# EAGLE design IRKit (EAGLE 6.5.0)
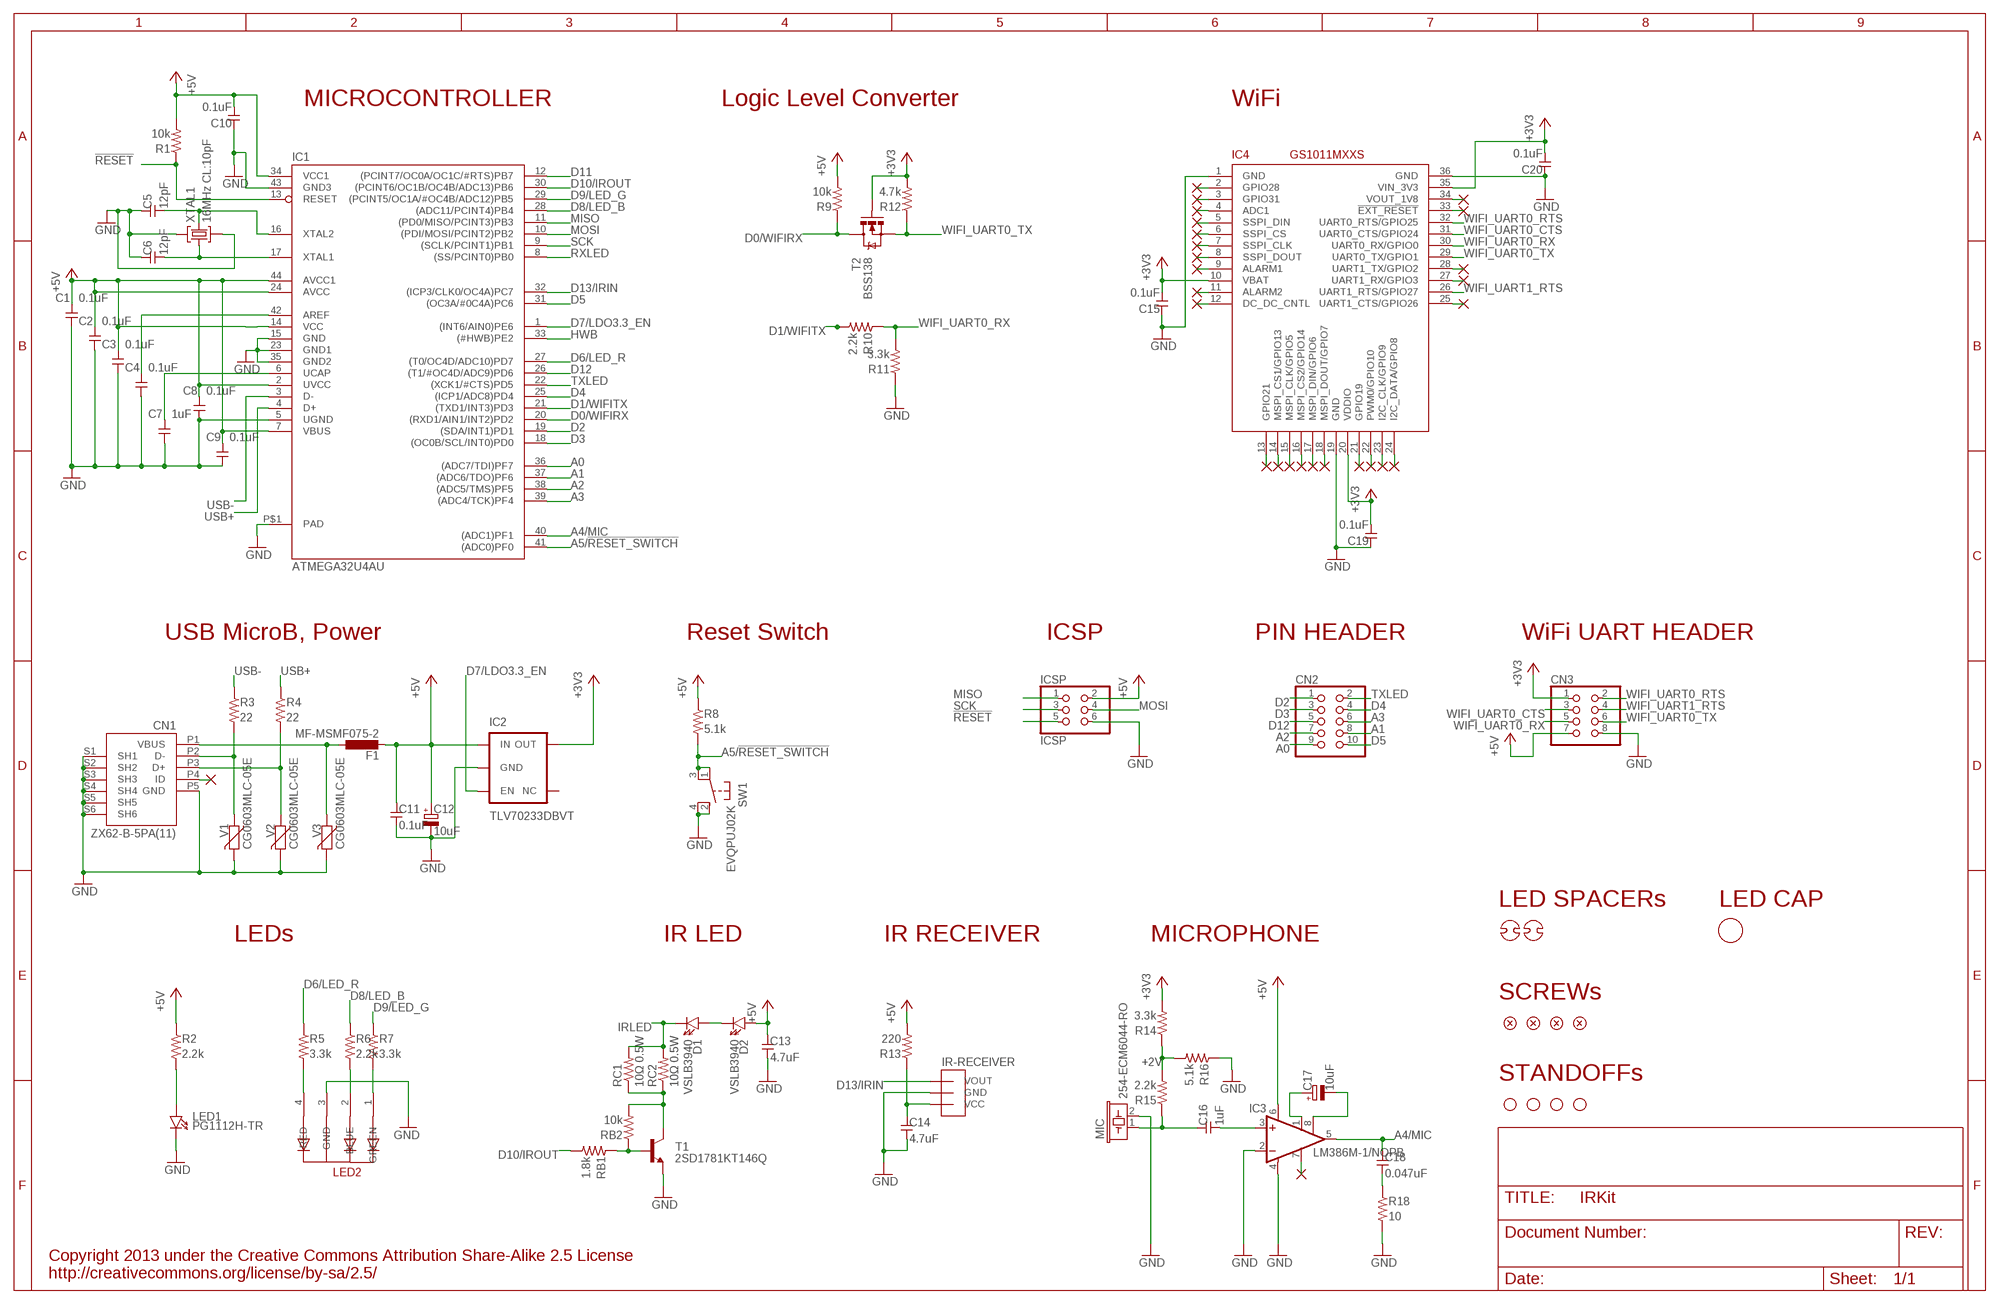
[diagram p0: schematic, sheet 1]

## Parts
C1  0.1uF  CAPACITOR2012  [SMD2012]
C2  0.1uF  CAPACITOR2012  [SMD2012]
C3  0.1uF  CAPACITOR2012  [SMD2012]
C4  0.1uF  CAPACITOR2012  [SMD2012]
C5  12pF  CAPACITOR2012  [SMD2012]
C6  12pF  CAPACITOR2012  [SMD2012]
C7  1uF  CAPACITOR2012  [SMD2012]
C8  0.1uF  CAPACITOR2012  [SMD2012]
C9  0.1uF  CAPACITOR2012  [SMD2012]
C10  0.1uF  CAPACITOR2012  [SMD2012]
C11  0.1uF  CAPACITOR2012  [SMD2012]
C12  10uF  CAPACITOR-POLPANASONIC_B  [PANASONIC_B]
C13  4.7uF  CAPACITOR2012  [SMD2012]
C14  4.7uF  CAPACITOR2012  [SMD2012]
C15  0.1uF  CAPACITOR2012  [SMD2012]
C16  1uF  CAPACITOR2012  [SMD2012]
C17  10uF  CAPACITOR-POLPANASONIC_B  [PANASONIC_B]
C18  0.047uF  CAPACITOR2012  [SMD2012]
C19  0.1uF  CAPACITOR2012  [SMD2012]
C20  0.1uF  CAPACITOR2012  [SMD2012]
CN1  ZX62-B-5PA(11)  USB-CONNECTORMICROB  [USB-MICROB]
CN2  PINHD-2X5  [2X05]
CN3  PINHD-2X4  [2X04]
D1  VSLB3940  LED-3MM  [LED3MM]
D2  VSLB3940  LED-3MM  [LED3MM]
F1  MF-MSMF075-2  L-EUL1812  [L1812]
IC1  ATMEGA32U4AU  [TQFP44-PAD]
IC2  TLV70233DBVT  TLV702XXSMD  [SOT23-5]
IC3  LM386M-1/NOPB  LM386M-1  [SO08]
IC4  GS1011MXXS  [GS1011MXXS]
ICSP  ICSP  PINHD-2X3  [2X03]
IR-RECEIVER  PL-IRM2161  [IR-RECEIVER]
LED1  PG1112H-TR  LED-2012  [LED2012]
LED2  5MMRGBLED  [LED5MMRGB]
LEDCAP1  LED-CAP  [LED-CAP]
MIC  254-ECM6044-RO  MICELECTRET_SMD  [MIC_SMD_4MM]
R1  10k  RESISTOR-US2012  [SMD2012]
R2  2.2k  RESISTOR-US2012  [SMD2012]
R3  22  RESISTOR-US2012  [SMD2012]
R4  22  RESISTOR-US2012  [SMD2012]
R5  3.3k  RESISTOR-US2012  [SMD2012]
R6  2.2k  RESISTOR-US2012  [SMD2012]
R7  3.3k  RESISTOR-US2012  [SMD2012]
R8  5.1k  RESISTOR-US2012  [SMD2012]
R9  10k  RESISTOR-US2012  [SMD2012]
R10  2.2k  RESISTOR-US2012  [SMD2012]
R11  3.3k  RESISTOR-US2012  [SMD2012]
R12  4.7k  RESISTOR-US2012  [SMD2012]
R13  220  RESISTOR-US2012  [SMD2012]
R14  3.3k  RESISTOR-US2012  [SMD2012]
R15  2.2k  RESISTOR-US2012  [SMD2012]
R16  5.1k  RESISTOR-US2012  [SMD2012]
R18  10  RESISTOR-US2012  [SMD2012]
RB1  1.8k  RESISTOR-US2012  [SMD2012]
RB2  10k  RESISTOR-US2012  [SMD2012]
RC1  10Ω 0.5W  R3225  [3225]
RC2  10Ω 0.5W  R3225  [3225]
SCREW1  flat-head M3 self-tapping  SCREW  [SCREW-M3]
SCREW2  flat-head M3 self-tapping  SCREW  [SCREW-M3]
SCREW3  flat-head M3 self-tapping  SCREW  [SCREW-M3]
SCREW4  flat-head M3 self-tapping  SCREW  [SCREW-M3]
SP1  LK-5  LED-SPACER-LK  [LED-SPACER-LK]
SP2  LK-5  LED-SPACER-LK  [LED-SPACER-LK]
STANDOFF1  STAND-OFF  [STAND-OFF]
STANDOFF2  STAND-OFF  [STAND-OFF]
STANDOFF3  STAND-OFF  [STAND-OFF]
STANDOFF4  STAND-OFF  [STAND-OFF]
SW1  EVQPUJ02K  TACTILE-SWITCHEVQPUJ02K  [TACTILE-SWITCH-EVQPUJ02K]
T1  2SD1781KT146Q  MMUN2211LT1-NPN-SC59-BEC  [SC59-BEC]
T2  BSS138  [SOT23]
V1  CG0603MLC-05E  VARISTORCN0603  [CT/CN0603]
V2  CG0603MLC-05E  VARISTORCN0603  [CT/CN0603]
V3  CG0603MLC-05E  VARISTORCN0603  [CT/CN0603]
XTAL1  16MHz CL:10pF  CRYSTAL-3.2-2.5  [CRYSTAL-3.2-2.5]

## Nets
!RESET: IC1.13(RESET) ICSP.5 R1.1
+2V: R14.1 R15.2 R16.2
+3V3 [3.3v]: C15.2 C19.2 C20.2 CN3.1 IC2.5(OUT) IC4.10(VBAT) IC4.20(VDDIO) IC4.35(VIN_3V3) R12.2 R14.2 T2.1(G)
+5V [power]: C1.2 C2.2 C3.2 C8.2 C9.2 C10.2 C11.1 C12.+ C13.1 CN3.7 D2.A F1.2 IC1.2(UVCC) IC1.7(VBUS) IC1.14(VCC) IC1.24(AVCC) IC1.34(VCC1) IC1.44(AVCC1) IC2.1(IN) IC3.6(VS) ICSP.2 R1.2 R2.1 R8.1 R9.2 R13.2
A0: CN2.9 IC1.36((ADC7/TDI)PF7)
A1: CN2.8 IC1.37((ADC6/TDO)PF6)
A2: CN2.7 IC1.38((ADC5/TMS)PF5)
A3: CN2.6 IC1.39((ADC4/TCK)PF4)
A4/MIC: C18.1 IC1.40((ADC1)PF1) IC3.5(OUT)
A5/!RESET_SWITCH: IC1.41((ADC0)PF0) R8.2 SW1.1(A) SW1.3(A)
AREF [power]: C4.2 IC1.42(AREF)
D0/WIFIRX: IC1.20((RXD1/AIN1/INT2)PD2) R9.1 T2.3(D)
D1/WIFITX: IC1.21((TXD1/INT3)PD3) R10.2
D2: CN2.1 IC1.19((SDA/INT1)PD1)
D3: CN2.3 IC1.18((OC0B/SCL/INT0)PD0)
D4: CN2.4 IC1.25((ICP1/ADC8)PD4)
D5: CN2.10 IC1.31((OC3A/#0C4A)PC6)
D6/LED_R: IC1.27((T0/OC4D/ADC10)PD7) R5.1
D7/LDO3.3_EN: IC1.1((INT6/AIN0)PE6) IC2.3(EN)
D8/LED_B: IC1.28((ADC11/PCINT4)PB4) R6.1
D9/LED_G: IC1.29((PCINT5/OC1A/#OC4B/ADC12)PB5) R7.1
D10/IROUT: IC1.30((PCINT6/OC1B/OC4B/ADC13)PB6) RB1.2
D11: IC1.12((PCINT7/OC0A/OC1C/#RTS)PB7)
D12: CN2.5 IC1.26((T1/#OC4D/ADC9)PD6)
D13/IRIN: IC1.32((ICP3/CLK0/OC4A)PC7) IR-RECEIVER.1(VOUT)
GND [gnd]: C1.1 C2.1 C3.1 C4.1 C5.1 C6.1 C7.1 C8.1 C9.1 C10.1 C11.2 C12.- C13.2 C14.2 C15.1 C19.1 C20.1 CN1.P5(GND) CN1.S1(SH1) CN1.S2(SH2) CN1.S3(SH3) CN1.S4(SH4) CN1.S5(SH5) CN1.S6(SH6) CN3.8 IC1.5(UGND) IC1.15(GND) IC1.23(GND1) IC1.35(GND2) IC1.43(GND3) IC1.P$1(PAD) IC2.2(GND) IC3.2(-IN) IC3.4(GND) IC4.1(GND) IC4.19(GND) IC4.36(GND) ICSP.6 IR-RECEIVER.2(GND) LED1.K LED2.3(GND) MIC.2 R11.1 R16.1 R18.2 SW1.2(B) SW1.4(B) T1.E V1.2 V2.2 V3.2 XTAL1.2(GND) XTAL1.4(GND)
HWB: IC1.33((#HWB)PE2)
IRLED [ir-power]: D1.K RC1.2 RC2.2
MICOUT: C16.1 MIC.1 R15.1
MISO: IC1.11((PD0/MISO/PCINT3)PB3) ICSP.1
MOSI: IC1.10((PDI/MOSI/PCINT2)PB2) ICSP.4
N$1: C17.- IC3.8(GAIN)
N$3: LED1.A R2.2
N$4: C16.2 IC3.3(+IN)
N$5: LED2.1(GREEN) R7.2
N$6: IC3.7(BYPASS)
N$8: C17.+ IC3.1(GAIN)
N$10: RB1.1 RB2.1 T1.B
N$11 [ir-power]: RB2.2 RC1.1 RC2.1 T1.C
N$14: C18.2 R18.1
N$16: C14.1 IR-RECEIVER.3(VCC) R13.1
N$17: LED2.2(BLUE) R6.2
N$18: IC4.2(GPIO28)
N$19: IC4.8(SSPI_DOUT)
N$20: IC4.9(ALARM1)
N$21: IC4.3(GPIO31)
N$22: IC4.4(ADC1)
N$23: IC4.5(SSPI_DIN)
N$24: IC4.6(SSPI_CS)
N$25: IC4.7(SSPI_CLK)
N$26: IC4.11(ALARM2)
N$27: IC4.12(DC_DC_CNTL)
N$28: IC4.13(GPIO21)
N$29: IC4.14(MSPI_CS1/GPIO13)
N$30: IC4.15(MSPI_CLK/GPIO5)
N$31: IC4.16(MSPI_CS2/GPIO14)
N$32: IC4.17(MSPI_DIN/GPIO6)
N$33: IC4.18(MSPI_DOUT/GPIO7)
N$34: IC4.21(GPIO19)
N$35: IC4.22(PWM0/GPIO10)
N$36: IC4.23(I2C_CLK/GPIO9)
N$37: IC4.24(I2C_DATA/GPIO8)
N$38: IC4.25(UART1_CTS/GPIO26)
N$39: IC4.27(UART1_RX/GPIO3)
N$40: IC4.28(UART1_TX/GPIO2)
N$41: LED2.4(RED) R5.2
N$43: IC4.34(VOUT_1V8)
N$44: IC4.33(!EXT_RESET)
N$48: CN1.P2(D-) R3.2 V1.1
N$51: CN1.P3(D+) R4.2 V2.1
N$52: CN1.P1(VBUS) F1.1 V3.1
N$58 [power]: D1.A D2.K
RXLED: IC1.8((SS/PCINT0)PB0)
SCK: IC1.9((SCLK/PCINT1)PB1) ICSP.3
TXLED: CN2.2 IC1.22((XCK1/#CTS)PD5)
UCAP: C7.2 IC1.6(UCAP)
USB+: IC1.4(D+) R4.1
USB-: IC1.3(D-) R3.1
USB-ID: CN1.P4(ID)
WIFI_UART0_CTS: CN3.3 IC4.31(UART0_CTS/GPIO24)
WIFI_UART0_RTS: CN3.2 IC4.32(UART0_RTS/GPIO25)
WIFI_UART0_RX: CN3.5 IC4.30(UART0_RX/GPIO0) R10.1 R11.2
WIFI_UART0_TX: CN3.6 IC4.29(UART0_TX/GPIO1) R12.1 T2.2(S)
WIFI_UART1_RTS: CN3.4 IC4.26(UART1_RTS/GPIO27)
XTAL1: C6.2 IC1.17(XTAL1) XTAL1.1(C1)
XTAL2: C5.2 IC1.16(XTAL2) XTAL1.3(C2)
Unconnected: IC2.4(NC)

## Notes on the sheet
- MICROCONTROLLER | Logic Level Converter | WiFi
- USB MicroB, Power | Reset Switch | ICSP | PIN HEADER | WiFi UART HEADER
- LED SPACERs | LED CAP
- LEDs | IR LED | IR RECEIVER | MICROPHONE
- SCREWs
- STANDOFFs
- Copyright 2013 under the Creative Commons Attribution Share-Alike 2.5 License
  http://creativecommons.org/license/by-sa/2.5/

## Library data of the parts
C1-C11 C13-C16 C18-C20 = my:CAPACITOR: Generic Capacitor
C12 C17 = my:CAPACITOR-POL: Generic Capacitor with Polarity
CN1 = my:USB-CONNECTOR
CN2 = my:PINHD-2X5: PIN HEADER
CN3 = my:PINHD-2X4: PIN HEADER
D1 D2 LED1 = my:LED: Through-hole LED
F1 = my:L-EU: INDUCTOR, European symbol
IC1 = my:ATMEGA32U4
IC2 = my:TLV702XX: TLV702xx http://www.tij.co.jp/jp/lit/ds/symlink/tlv70233.pdf http://www.ti.com/lit/ds/slvsag6b/slvsag6b.pdf 300-mA, Low-IQ, Low-Dropout Regulator
IC3 = my:LM386?-*: Low Voltage Audio Power Amplifier Source: http://cache.national.com/ds/LM/LM386.pdf
IC4 = my:GS1011MXXS
ICSP = my:PINHD-2X3: PIN HEADER
IR-RECEIVER = my:PL-IRM2161: PL-IRM2161-XD1 IR Receiver http://akizukidenshi.com/catalog/g/gI-06491/ http://akizukidenshi.com/download/ds/paralight/PL-IRM2161-XD1.pdf
LED2 = my:5MMRGBLED
LEDCAP1 = my:LED-CAP
MIC = my:MIC: Omni-directional electret condenser microphone.
R1-R16 R18 RB1 RB2 = my:RESISTOR-US: Generic Registor
RC1 RC2 = my:R: RESISTOR
SCREW1-SCREW4 = my:SCREW
SP1 SP2 = my:LED-SPACER
STANDOFF1-STANDOFF4 = my:STAND-OFF: #4 Stand Off This is the mechanical footprint for a #4 phillips button head screw. Use the keepout ring to avoid running the screw head into surrounding components. SKU : PRT-00447
SW1 = my:TACTILE-SWITCH: TACTILE SWITCH
T1 = transistor:*-NPN-: NPN Transistror BF959 corrected 2008.03.06
T2 = my:BSS138
V1-V3 = my:VARISTOR: VARISTOR
XTAL1 = my:CRYSTAL-3.2-2.5

## Net classes
0 default: width 0.254 mm
1 power: width 0.406 mm
2 ir-power: width 0.813 mm
3 gnd: width 0.406 mm
4 3.3v: width 0.406 mm

## Board
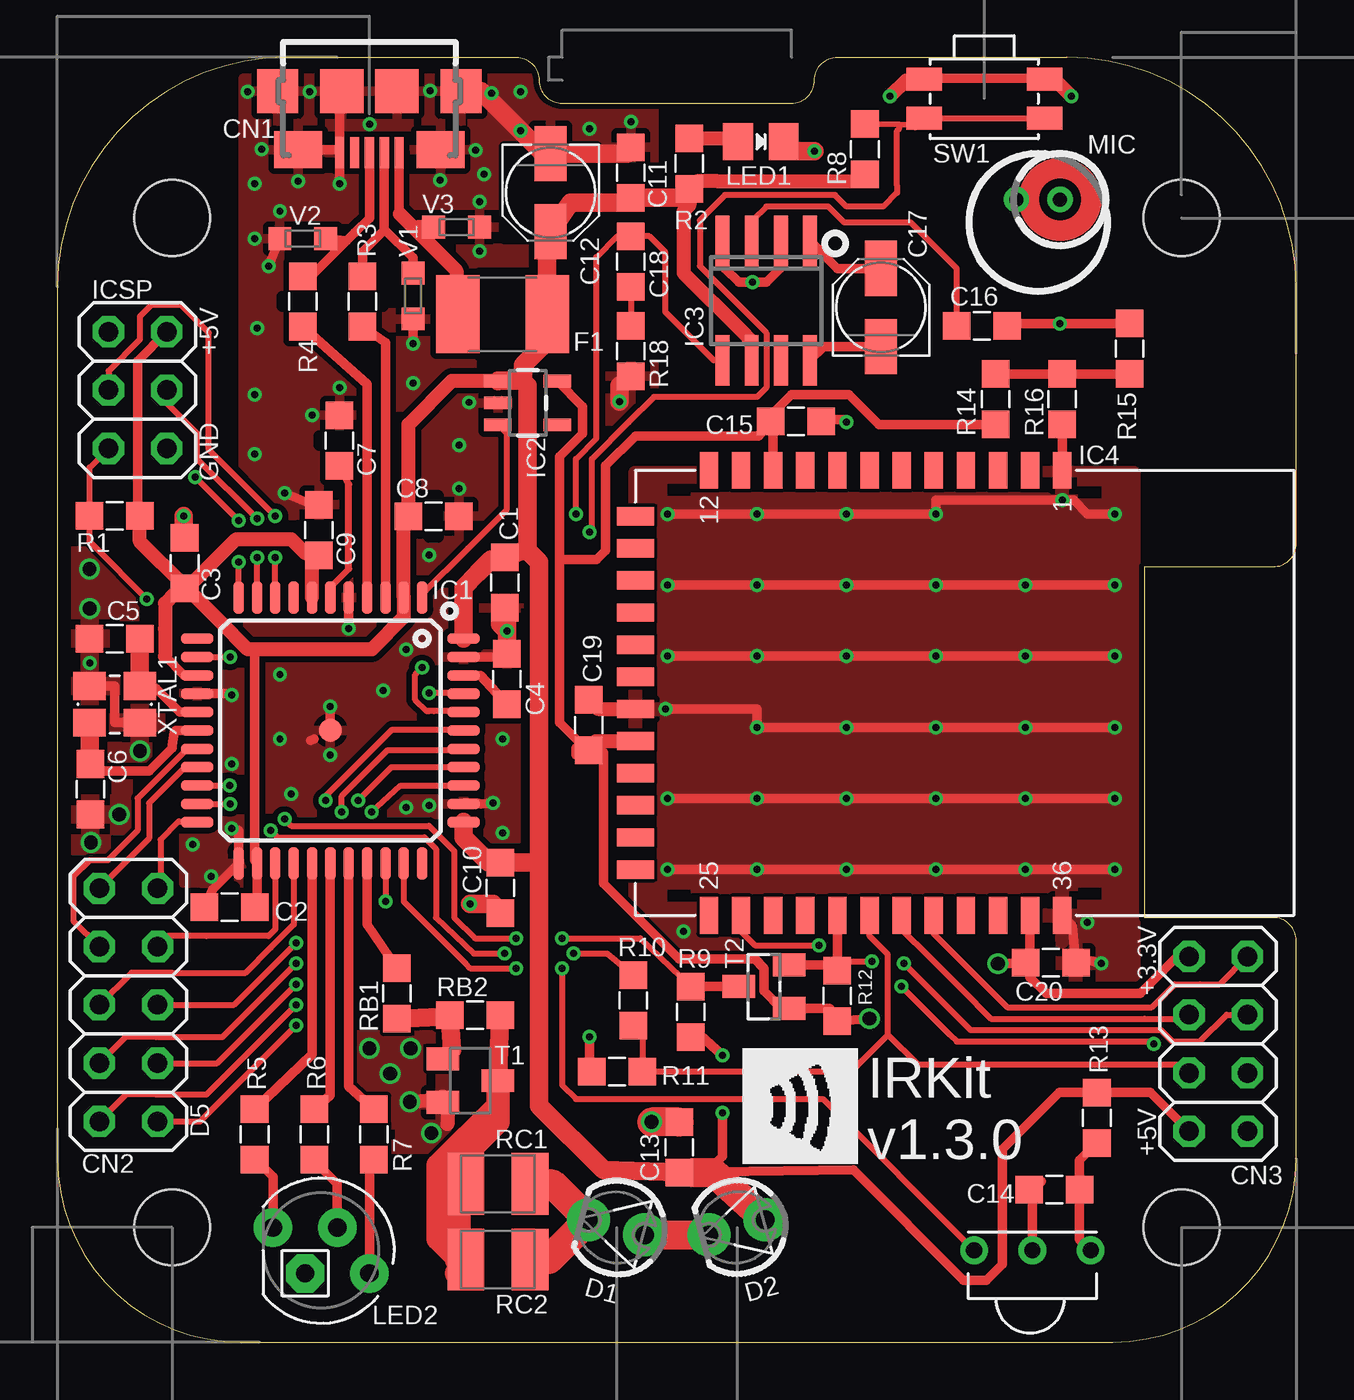
[diagram p1: board, top side]
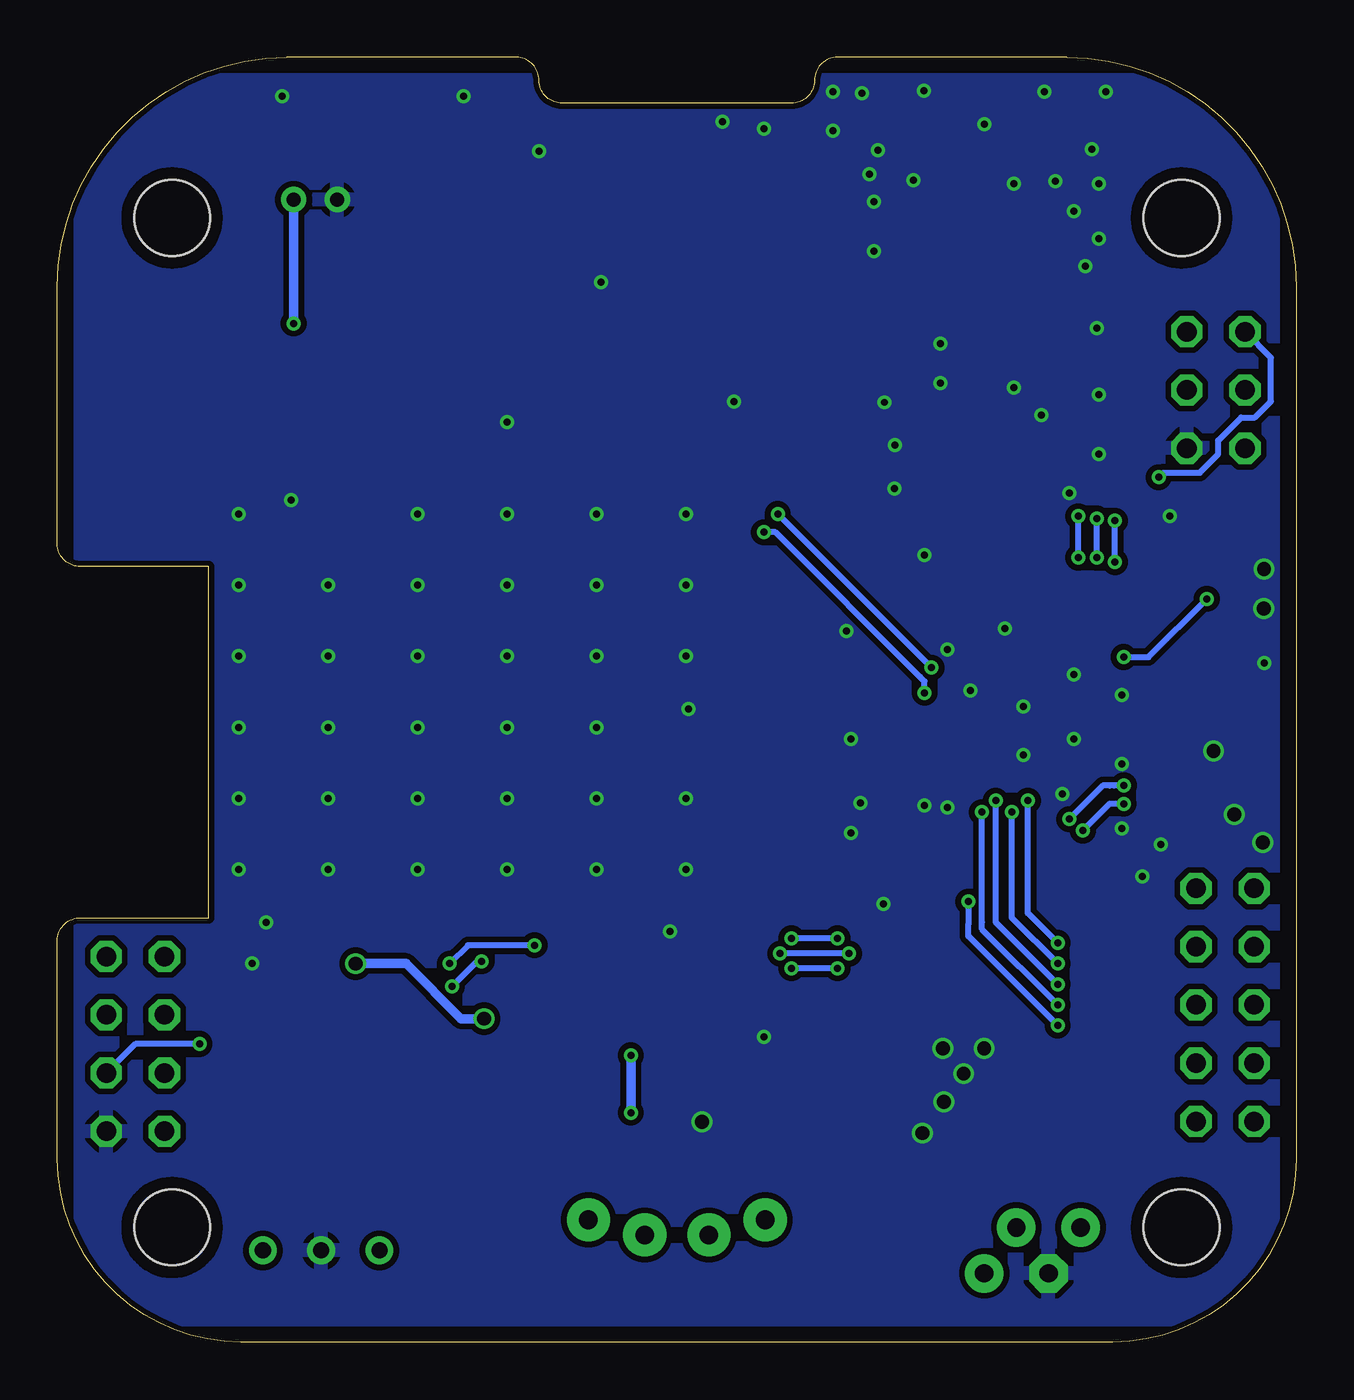
[diagram p2: board, bottom side, seen from below]

Size 54 x 56 mm. Coordinates in mm from the lower left corner, seen from the top.
Outline: 8,0 46,0 arc90 54,8 54,17.5 arc90 53,18.5 47.4,18.5 47.4,33.6 47.4,33.8 53,33.8 arc90 54,34.8 54,46 arc90 44,56 34,56 arc90 33,55 arc-90 32,54 22,54 arc-90 21,55 arc90 20,56 10,56 arc90 0,46 0,8 arc90 8,0
Copper layers (1*16): Top 0.035mm / dielectric 1.5mm / Bottom 0.035mm
Design rules "Fusion_eagle_rule_v1.1": minimum track width 6mil, minimum drill 12mil, track to track 6mil, track to pad 6mil, pad to pad 6mil, via to via 6mil, smd to smd 0mil, copper to edge 10mil, drill to drill 10mil, minimum pad ring 10mil, minimum via ring 6mil, stop-mask expansion 2mil, vias tented up to drill 100mil, thermal gap 10mil

### Footprints (pad centres in the part's own frame; a part is rotated, then mirrored left to right if it is on the bottom)
SMD2012 = smd 1.2 x 1.2: 1 -1.1,0; 2 1.1,0
PANASONIC_B = smd 2.4 x 1.4: + 1.7,0; - -1.7,0
USB-MICROB = smd 0.4 x 1.35: P1 -1.3,2.675; P2 -0.65,2.675; P3 0,2.675; P4 0.65,2.675; P5 1.3,2.675 | smd 1.8 x 1.9: S1 -4,0; S2 4,0 | smd 2.1 x 1.6: S3 -3.1,2.55; S4 3.1,2.55 | smd 1.9 x 1.9: S5 -1.2,0; S6 1.2,0
2X05 = drill 0.85 octagon: 1 -5.08,-1.27; 2 -5.08,1.27; 3 -2.54,-1.27; 4 -2.54,1.27; 5 0,-1.27; 6 0,1.27; 7 2.54,-1.27; 8 2.54,1.27; 9 5.08,-1.27; 10 5.08,1.27
2X04 = drill 0.85 octagon: 1 -3.81,-1.27; 2 -3.81,1.27; 3 -1.27,-1.27; 4 -1.27,1.27; 5 1.27,-1.27; 6 1.27,1.27; 7 3.81,-1.27; 8 3.81,1.27
LED3MM = drill 0.813 pad 1.88: A -1.27,0; K 1.27,0
L1812 = smd 1.9 x 3.4: 1 -1.95,0; 2 1.95,0
TQFP44-PAD = smd 1.4 x 0.45: 1 -5.8,4; 2 -5.8,3.2; 3 -5.8,2.4; 4 -5.8,1.6; 5 -5.8,0.8; 6 -5.8,0; 7 -5.8,-0.8; 8 -5.8,-1.6; 9 -5.8,-2.4; 10 -5.8,-3.2; 11 -5.8,-4; 23 5.8,-4; 24 5.8,-3.2; 25 5.8,-2.4; 26 5.8,-1.6; 27 5.8,-0.8; 28 5.8,0; 29 5.8,0.8; 30 5.8,1.6; 31 5.8,2.4; 32 5.8,3.2; 33 5.8,4 | smd 0.45 x 1.4: 12 -4,-5.8; 13 -3.2,-5.8; 14 -2.4,-5.8; 15 -1.6,-5.8; 16 -0.8,-5.8; 17 0,-5.8; 18 0.8,-5.8; 19 1.6,-5.8; 20 2.4,-5.8; 21 3.2,-5.8; 22 4,-5.8; 34 4,5.8; 35 3.2,5.8; 36 2.4,5.8; 37 1.6,5.8; 38 0.8,5.8; 39 0,5.8; 40 -0.8,5.8; 41 -1.6,5.8; 42 -2.4,5.8; 43 -3.2,5.8; 44 -4,5.8 | smd 1 x 1: P$1 0,0
SOT23-5 = smd 0.55 x 1.2: 1 -0.95,-1.3; 2 0,-1.3; 3 0.95,-1.3; 4 0.95,1.3; 5 -0.95,1.3
SO08 = smd 0.6 x 2.2: 1 -1.905,-2.6; 2 -0.635,-2.6; 3 0.635,-2.6; 4 1.905,-2.6; 5 1.905,2.6; 6 0.635,2.6; 7 -0.635,2.6; 8 -1.905,2.6
GS1011MXXS = smd 1.6 x 0.8: 1 0,18.6; 2 0,17.2; 3 0,15.8; 4 0,14.4; 5 0,13; 6 0,11.6; 7 0,10.2; 8 0,8.8; 9 0,7.4; 10 0,6; 11 0,4.6; 12 0,3.2; 25 19.4,3.2; 26 19.4,4.6; 27 19.4,6; 28 19.4,7.4; 29 19.4,8.8; 30 19.4,10.2; 31 19.4,11.6; 32 19.4,13; 33 19.4,14.4; 34 19.4,15.8; 35 19.4,17.2; 36 19.4,18.6 | smd 0.8 x 1.6: 13 2,0; 14 3.4,0; 15 4.8,0; 16 6.2,0; 17 7.6,0; 18 9,0; 19 10.4,0; 20 11.8,0; 21 13.2,0; 22 14.6,0; 23 16,0; 24 17.4,0
2X03 = drill 0.85 octagon: 1 -2.54,-1.27; 2 -2.54,1.27; 3 0,-1.27; 4 0,1.27; 5 2.54,-1.27; 6 2.54,1.27
IR-RECEIVER = drill 0.7: 1 -2.54,0; 2 0,0; 3 2.54,0
LED2012 = smd 1.3 x 1.6: A -1,0; K 1,0
LED5MMRGB = drill 0.8 pad 1.676: 1 2.1,-1; 2 0.7,1; 4 -2.1,1 | drill 0.8 pad 1.676 octagon: 3 -0.7,-1
MIC_SMD_4MM = drill 0.6: 1 1.9,0; 2 0,0
3225 = smd 1.6 x 2.7: 1 -1.4,0; 2 1.4,0
STAND-OFF = hole 3.302: 0,0
TACTILE-SWITCH-EVQPUJ02K = smd 1.55 x 1: 1 -2.625,-0.85; 2 -2.625,0.85; 3 2.625,-0.85; 4 2.625,0.85
SC59-BEC = smd 1 x 1.4: B -0.95,-1.2; C 0,1.2; E 0.95,-1.2
SOT23 = smd 1 x 1.4: 1 -0.95,-1.1; 2 0.95,-1.1; 3 0,1.1
CT/CN0603 = smd 1 x 1: 1 -1,0; 2 1,0
CRYSTAL-3.2-2.5 = smd 1.4 x 1.2: 1 -1.1,-0.8; 2 1.1,-0.8; 3 1.1,0.8; 4 -1.1,0.8

### Placement (x,y rotation side)
C1  19.5,33.1 90 top
C2  7.51,18.95 0 top
C3  5.55,33.95 270 top
C4  19.6,28.9 270 top
C5  2.5,30.66 0 top
C6  1.44,24.1 90 top
C7  12.3,39.3 270 top
C8  16.4,36 180 top
C9  11.4,35.4 270 top
C10  19.3,19.8 90 top
C11  25,50.97 90 top
C12  21.5,50.1 270 top
C13  27.1,8.5 90 top
C14  43.45,6.65 180 top
C15  32.2,40.14 180 top
C16  40.3,44.3 180 top
C17  35.9,45.1 90 top
C18  25,47.1 270 top
C19  23.16,26.9 270 top
C20  43.3,16.54 180 top
CN1  13.6,54.52 180 top
CN2  3.1,14.7 270 top
CN3  50.6,13 270 top
D1  24.38,5 165 top
D2  29.62,5 195 top
F1  19.4,44.8 0 top
IC1  11.9,26.66 270 top
IC2  20.5,40.94 270 top
IC3  30.9,45.4 180 top
IC4  25.2,38 270 top
ICSP  3.5,41.5 270 top
IR-RECEIVER  42.5,4 0 top
LED1  30.66,52.33 0 top
LED2  11.5,4 0 top
LEDCAP1  11.5,-0.7 0 top
MIC  41.8,49.8 0 top
R1  2.5,36.02 0 top
R2  27.55,51.38 90 top
R3  13.3,45.36 90 top
R4  10.7,45.36 90 top
R5  8.6,9.05 270 top
R6  11.2,9.05 270 top
R7  13.8,9.05 270 top
R8  35.2,52 90 top
R9  27.6,14.4 270 top
R10  25.1,14.9 90 top
R11  24.4,11.8 0 top
R12  34,15.1 270 top
R13  45.31,9.78 90 top
R14  40.9,41.1 270 top
R15  46.74,43.3 270 top
R16  43.8,41.1 90 top
R18  25,43.2 270 top
RB1  14.8,15.2 90 top
RB2  18.2,14.26 0 top
RC1  19.2,6.9 0 top
RC2  19.2,3.6 0 top
SCREW1  -7.4,-11.1 0 top  (outside the outline)
SCREW2  -8.4,-12.2 0 top  (outside the outline)
SCREW3  -9.4,-13.3 0 top  (outside the outline)
SCREW4  -10.4,-14.4 0 top  (outside the outline)
SP1  29.62,5 195 top
SP2  24.38,5 345 top
STANDOFF1  49,5 0 top
STANDOFF2  5,5 0 top
STANDOFF3  49,49 0 top
STANDOFF4  5,49 0 top
SW1  40.4,54.2 0 top
T1  18,11.4 270 top
T2  30.8,15.5 90 top
U$1  [IRKIT-LOGO]  29.9,7.8 0 top
V1  15.5,45.6 270 top
V2  10.7,48.1 180 top
V3  17.4,48.6 0 top
XTAL1  2.5,27.8 0 top

### Tracks (layer width: path | path; a pad name or v marks a point on that pad's centre or on a via)
!RESET  (via drill 0.3)
  Top 0.254: IC1.13 v7.53,29.86 | v3.9,32.4 1.6,34.7 1.4,34.9 R1.1 1.4,38.13 ICSP.5
  Bottom 0.254: v7.53,29.86 6.44,29.86 v3.9,32.4
+2V
  Top 0.406: R14.1 R16.2 R15.2
+3V3  (via drill 0.6)
  Top 0.406: IC4.35 42.4,16.8 | 42.4,16.8 42.4,16.74 | C19.2 22.6,25.6 22.6,25.7 22.6,25.9 | C19.2 23,25.9 21.9,27 21.9,29.3 21.9,34.1 | 31.2,40.1 IC4.10 | 31.2,40.1 C15.2 30.56,39.5 25.2,39.5 23.9,38.2 23.9,34.5 23.5,34.1 21.9,34.1 | 31.9,14.8 T2.1 | C19.2 23.46,26.2 | IC4.20 23.3,26.2 23.8,25.7 23.8,20 27.1,16.7 30.1,16.7 30.4,16.7 30.8,16.3 30.8,15.3 31.55,14.55 T2.1 | C20.2 42.4,16.44 42.4,15.9 43.1,15.2 47,15.2 47.2,15.2 48.2,16.2 48.81,16.81 CN3.1 | 42.4,16.8 42.3,16.8 C20.2 | T2.1 33.65,14.55 R12.2 v35.4,14.1 | v41,16.5 42.26,16.5 C20.2 | 31.2,40.1 31.2,40.5 32,41.3 34.5,41.3 35.8,40 36,40 R14.2 | 21.9,34.1 21.9,38.6 22.9,39.6 22.9,40.5 22.9,40.79 IC2.5
  Top 0.61: 23,25.9 C19.2 | 23.46,26.2 IC4.20
  Bottom 0.406: v35.4,14.1 36.4,14.1 38.8,16.5 v41,16.5
+5V  (via drill 0.3)
  Top 0.406: C2.2 8.7,19.41 IC1.24 8.6,21 8.6,29.9 8.6,30.2 | ICSP.2 3.5,42.77 3.5,38.3 3.5,36.62 R1.2 | 5.1,32.6 5.1,32.7 C3.2 | 4.7,29.9 5.54,29.06 IC1.14 | 21.35,46.73 21.35,47.9 | v29,10 29,8.1 28.4,7.5 27.7,7.4 | v29,12.5 28,13.4 R9.2 | C13.1 34.7,7.5 39.5,2.7 40.5,2.7 41.2,3.4 41.2,8.4 43.68,10.88 R13.2 | 44.99,10.7 R13.2 | R13.2 47.64,10.88 CN3.7 | C10.2 19.4,20.9 | 27.3,49.3 27.3,49.5 27.15,49.87
  Top 0.61: 4.8,43.7 ICSP.2 | IC1.7 11.1,34.1 C9.2 10.8,34.4 10.2,35 7.8,35 5.75,32.95 5.55,32.95 | 5.55,32.95 7.1,31.4 8.3,30.2 8.6,30.2 13.7,30.2 15.1,31.6 IC1.2 15.1,35.9 C8.2 15.3,40 17.2,41.9 19.19,41.9 IC2.1 | 5.55,32.95 C3.2 | 5.1,32.6 4.7,32.2 4.7,31.1 4.7,29.9 | CN3.7 | 5.55,32.95 3.6,34.9 R1.2 | R8.1 35.2,50.6 28.8,50.6 27.88,50.6 R2.1 27.55,49.55 27.3,49.3 27.3,46.6 29.8,44.1 30.27,43.63 IC3.6
  Top 0.813: 20.5,34.5 20.5,34.55 20.5,41.7 20.3,41.9 | 20.5,34.5 21,34 21,20.9 | 20.5,34.5 20.3,34.5 C1.2 18.9,34.1 18.3,33.5 | 18.6,33.8 18.3,33.5 | 18.3,33.5 17.7,32.9 IC1.44 | 19.4,20.9 21,20.9 | 21,20.9 21,10.3 23.8,7.5 C13.1 27.7,7.4 | IC1.34 17.7,22 18.8,20.9 C10.2 | 27.15,49.87 C11.1 24.7,49.67 22.37,49.67 C12.+ 21.35,48.55 21.35,47.9 F1.2 21.35,43.62 20.3,42.58 20.3,41.9 | 20.3,41.9 19.21,41.9 IC2.1
  Top 1.27: 27.7,7.4 28.58,7.4 D2.A
  Bottom 0.406: v29,10 v29,12.5
A0  (via drill 0.3)
  Top 0.254: IC1.36 15.06,24.26 14.96,24.26 v13.7,23.1 | CN2.9 3.01,10.8 4.3,10.8 6.5,10.8 v10.4,14.7
  Bottom 0.254: v13.7,23.1 13.7,18.3 13.7,18 v10.4,14.7
A1  (via drill 0.3)
  Top 0.254: 17.7,25 IC1.37 14.56,25.06 v13.1,23.6 | CN2.8 6.96,12.16 v10.4,15.6
  Bottom 0.254: v10.4,15.6 13.1,18.3 v13.1,23.6
A2  (via drill 0.3)
  Top 0.254: CN2.7 2.97,13.3 4.3,13.3 4.4,13.3 7.2,13.3 v10.4,16.5 | 17.7,25.8 IC1.38 17.64,25.8 15.1,25.8 | v12.4,23.1 12.4,23.8 14.4,25.8 15.1,25.8 | 14.5,25.8 15.1,25.8
  Bottom 0.254: v12.4,23.1 12.4,18.8 12.4,18.5 v10.4,16.5
A3  (via drill 0.3)
  Top 0.254: v11.7,23.6 11.7,23.8 14.6,26.7 17.66,26.7 IC1.39 | CN2.6 7.7,14.7 v10.4,17.4
  Bottom 0.254: v11.7,23.6 11.7,18.9 11.7,18.7 v10.4,17.4
A4/MIC  (via drill 0.3)
  Top 0.254: 17.7,27.4 IC1.40 17.66,27.5 16.4,27.5 16.2,27.5 16.1,27.5 15.6,28 15.6,29.1 v15.9,29.4 | IC3.5 28.6,42.8 26.5,44.9 26.5,47.5 25.8,48.2 C18.1 24.4,48.2 23.5,47.3 23.5,46.5 23.5,39.4 22.6,38.5 v22.6,36.1
  Bottom 0.254: v15.9,29.4 v22.6,36.1
A5/!RESET_SWITCH  (via drill 0.3)
  Top 0.254: SW1.3 SW1.1 37.5,53.08 36.7,53.09 | IC1.41 17.66,28.3 v16.2,28.3 | v23.2,35.3 23.3,35.4 23.3,38.5 24.9,40.1 26,41.2 26.1,41.2 30.5,41.2 30.9,41.6 30.9,44 28,46.9 28,48.9 29.1,50 33.9,50 34.4,49.5 34.7,49.5 36,49.5 36.6,50.1 36.6,50.4 36.6,52.8 36.7,52.9 36.7,53 36.7,53.09 | R8.2 36.7,53.09
  Top 0.305: 37.4,52.98 SW1.1
  Bottom 0.254: v23.2,35.3 22.7,35.3 16.4,29 16.2,28.8 v16.2,28.3
AREF
  Top 0.406: IC1.42 18.44,29.06 C4.2
D0/WIFIRX  (via drill 0.3)
  Top 0.254: IC1.20 v7.51,24.26 | v20,17.6 18.2,17.6 17.3,18.5 17.3,21.4 16.2,22.5 10.2,22.5 v9.9,22.8 | v22,17.6 25.4,17.6 R9.1
  Top 0.406: R9.1 T2.3
  Bottom 0.254: v20,17.6 v22,17.6 | v7.51,24.26 7.74,24.26 7.94,24.26 8.14,24.26 8.44,24.26 v9.9,22.8
D1/WIFITX  (via drill 0.3)
  Top 0.254: IC1.21 v7.53,23.46 | v19.49,16.94 18.15,16.94 16.5,18.5 16.5,21.5 16,22 9.6,22 9.5,22.1 v9.3,22.3 | v22.5,16.94 23.96,16.94 R10.2
  Bottom 0.254: v19.49,16.94 v22.5,16.94 | v7.53,23.46 8.14,23.46 v9.3,22.3
D2
  Top 0.254: IC1.19 5.56,25.06 4,23.5 4,21.95 CN2.1
D3
  Top 0.254: IC1.18 5.66,25.86 3.5,23.7 3.5,22.3 2.2,21 1.4,21 0.7,20.3 0.7,18.37 CN2.3
D4
  Top 0.254: IC1.25 9.5,18 9.2,17.7 6.5,17.7 4.83,17.7 CN2.4 4.4,17.2
D5  (via drill 0.3)
  Top 0.254: IC1.31 v14.3,19.2 | CN2.10 6.22,9.62 v10.4,13.8
  Bottom 0.254: v14.3,19.2 14.3,18.2 14.3,17.7 v10.4,13.8
D6/LED_R
  Top 0.406: IC1.27 11.1,12.55 R5.1
D7/LDO3.3_EN
  Top 0.254: 19.6,40.09 IC2.3 19.6,39.59 19.6,36.3 17.9,34.6 15.9,32.6 IC1.1
D8/LED_B
  Top 0.406: IC1.28 11.9,10.75 R6.1
D9/LED_G
  Top 0.254: 13.8,10.1 R7.1
  Top 0.406: IC1.29 12.7,11.15 R7.1
D10/IROUT
  Top 0.406: IC1.30 13.5,18.2 RB1.2
D12
  Top 0.254: IC1.26 10.3,18.2 9.3,17.2 8.2,16.1 5,16.1 3.23,16.1 CN2.5
D13/IRIN  (via drill 0.3)
  Top 0.254: IC1.32 15.1,19.2 17.8,16.5 18,16.3 v20,16.3 | v22,16.3 22,11.2 22.6,10.6 32.1,10.6 33.36,10.6 IR-RECEIVER.1
  Bottom 0.254: v20,16.3 v22,16.3
GND  (via drill 0.3, 0.6)
  Top 0.406: IC1.P$1 v11.9,27.7 | v45.5,16.5 44.29,16.8 C20.1 44.25,18.15 IC4.36 | IC1.5 v12.7,31.1 | C2.1 6.76,19.73 IC1.23 7.9,22.3 | v7.6,28.2 7.34,28.26 6.24,28.26 6.1,28.3 | 6.1,28.3 IC1.15 | 6.1,28.3 IC1.15 | 6.1,28.3 IC1.15 | C12.- 21.3,51.7 | 24.9,52 C11.2 25.2,52 | C6.1 1.5,23.3 C6.1 | v19,23.5 18.46,23.46 18.3,23.5 17.7,23.5 IC1.35 | C9.1 11.1,36.5 v9.9,37 | V1.2 v15.5,43.52 | V2.2 v9.2,46.9 | 19.46,29.86 IC1.43 | C6.1 1.1,23.2 C6.1 | 5.5,35 C3.1 | SW1.4 42.8,55.1 37.6,55.1 SW1.2 37.4,55 | v46.1,36.1 44.9,36.1 44.3,36.7 v43.8,36.7 43.6,36.7 38.3,36.7 38.3,36.3 v38.3,36.1 34.6,36.1 v34.4,36.1 30.7,36.1 v30.5,36.1 v26.6,36.1 | v26.6,33 v30.5,33 30.7,33 v34.4,33 34.6,33 v38.3,33 38.5,33 v42.2,33 42.4,33 v46.1,33 | v26.6,29.9 v30.5,29.9 30.7,29.9 v34.4,29.9 34.6,29.9 v38.3,29.9 38.5,29.9 v42.2,29.9 42.4,29.9 v46.1,29.9 | v26.5,27.6 30.5,27.6 v30.5,26.8 30.7,26.8 v34.4,26.8 34.6,26.8 v38.3,26.8 38.5,26.8 v42.2,26.8 42.4,26.8 v46.1,26.8 | v26.6,23.7 v30.5,23.7 30.7,23.7 v34.4,23.7 34.6,23.7 v38.3,23.7 38.5,23.7 v42.2,23.7 42.4,23.7 v46.1,23.7 | v26.6,20.6 v30.5,20.6 30.7,20.6 v34.4,20.6 34.6,20.6 v38.3,20.6 38.5,20.6 v42.2,20.6 42.4,20.6 v46.1,20.6 | 43.8,40.2 R16.1 IC4.1 | C15.1 33.2,40.2 34.3,40.2 v34.4,40.1 | CN1.S6 12.8,54.4 CN1.S6 | IR-RECEIVER.2 42.5,6.6 42.9,7 C14.2 | R11.1 23.2,12.1 v23.2,13.3 | LED1.K 31.89,51.9 | XTAL1.4 2.5,28.6 2.5,27 XTAL1.2 | CN1.P5 v12.3,50.5 | CN1.S4 12.3,51.98 CN1.P5 | CN1.S6 12.3,54.52 CN1.P5 | IC3.4 | IC3.4 29,47.8 29.1,47.7 29.1,46.8 29.7,46.2 v30.3,46.2 30.9,46.2 31.5,46.8 31.5,48 IC3.2 | IC4.19 | 11.2,26.3 11.04,26.23 11.2,26.3
  Top 0.61: 37.4,55 37,55 v36.3,54.3 | SW1.4 43.45,55.05 v44.2,54.3 | T1.E 17,10.45 17,9.5 | v15.36,10.47 16.8,10.6 | C19.1 23.56,27.6 IC4.19
  Top 0.813: 19.46,29.86 C4.1 v19.6,31 | C1.1 19.6,31.8 v19.6,31 | 21.3,51.7 18.48,54.52 CN1.S1 | 25.2,52 25.1,52.1 | 19.3,31.3 v19.6,31 | v18,19.1 19,19.1 C10.1 | 31.89,51.9 v33,51.9 | R18.2 24.5,41.7 v24.5,41 | C12.- 24.82,51.8 C11.2 | 16.8,10.6 T1.E | 5.5,35 v5.5,36
  Top 1.27: C13.2 v25.9,9.6
  other vias: 7.6,22.4 2.7,23 11.1,40.4 1.4,33.7 1.41,31.98 1.46,21.77 16.2,23.4 9.7,29.1 9.7,26.3 11.9,25.6 14.2,28.4 8.6,38.7 12.3,41.6 10.5,50.6 8.3,54.5 8.6,41.3 8.7,44.2 17.51,37.2 7.6,25.2 16.69,50.64 18.4,47.55 18.93,54.44 8.6,48.1 15.5,41.8 5.9,21.7 6.7,20.3 17.5,39.1 13.6,53.09 16.24,54.55 18.23,51.96 10.99,54.5 8.9,52 19.4,26.3 19.4,22.2 10.2,23.9 15.2,23.3 13.6,12.8 20.2,54.5 20.2,52.8 25,53.2 23.2,52.9 18.4,49.7 44.9,18.3 17.95,40.96 15.4,12.8 15.2,30.2 9.7,49.3 8.6,50.5 18.6,50.9 16.3,9.11 14.5,11.7 3.6,25.76 1.4,29.6 27.3,17.9 16.21,34.3
  pour Bottom (isolate 0.254): 1,1 1,55 53,55 53,1
  pour Top: 1,35.3 4.3,35.3 4.3,21.1 1,21.1
  pour Top (isolate 0.254): 5.5,33.1 20,33.1 20,20 5.5,20
  pour Top (isolate 0.254): 26,32.2 8.1,32.2 8.1,55.1 26,55.1
  pour Top: 25.2,37.9 46.9,37.9 46.9,16 25.2,16
  pour Top: 12.9,13.3 17.1,13.3 17.2,8.5 13,8.5
IRLED
  Top 1.27: RC1.2 21.58,6.9 D1.K 21.42,3.6 RC2.2
MICOUT  (via drill 0.3)
  Top 0.406: R15.1 v43.7,44.4 41.5,44.4 C16.1
  Bottom 0.406: MIC.1 v43.7,44.4
MISO  (via drill 0.3)
  Top 0.254: IC1.11 v7.9,34 | v7.9,35.8 v6,37.7
  Bottom 0.254: ICSP.1 1.1,42.91 1.1,41 1.8,40.3 2.4,40.3 3.4,39.3 3.4,38.7 4.2,37.9 5.8,37.9 v6,37.7 | v7.9,34 v7.9,35.8
MOSI  (via drill 0.3)
  Top 0.254: IC1.10 v8.7,34.2 | ICSP.4 4.77,40.93 6.1,39.6 6.1,38.5 v8.7,35.9
  Bottom 0.254: v8.7,34.2 v8.7,35.9
N$1
  Top 0.406: C17.- 33.41,43.4 IC3.8
N$3
  Top 0.61: R2.2 29.51,52.48 LED1.A
N$4
  Top 0.254: C16.2 39.2,46.8 37.2,48.8 34.3,48.8 33.6,49.5 30.9,49.5 30.3,48.9 30.3,48.03 IC3.3
N$5
  Top 0.254: 13.6,7.8 13.8,8 R7.2 13.6,7.7
  Top 0.406: LED2.1 13.6,7.7
N$8
  Top 0.406: C17.+ 34.01,46.8 IC3.1
N$10
  Top 0.813: RB1.1 17.14,14.2 RB2.1 17.2,12.75 T1.B
N$11
  Top 0.813: RB2.2 T1.C
  Top 1.016: RC1.1 17.5,7.9 | 17.5,7.9 17.5,8 17.5,7.9 | T1.C 19.2,10.4 19.2,10.3 | RC2.1 17.4,3.6 17.4,3.7 16.6,4.5 16.6,7.7 19.2,10.3 | 17.5,7.9 17.5,3.1 17.4,3 | 19.2,10.3 19.2,9.6 17.5,7.9
N$14
  Top 0.254: C18.2 R18.1
N$16
  Top 0.406: IR-RECEIVER.3 44.55,4.49 C14.1 44.55,7.92 R13.1
N$17
  Top 0.254: 11.2,8 R6.2 11.2,7.9
  Top 0.406: 11.2,7.9 12.2,6.9 LED2.2
N$41
  Top 0.254: 8.6,8 R5.2 | 9.4,7.1 9.4,7.2
  Top 0.406: 9.4,7.2 8.6,8 | LED2.4 9.4,7.1
N$48
  Top 0.406: R3.2 13.3,47.54 14.26,48.5 | 14.26,48.5 15.5,47.26 V1.1 | 14.26,48.5 14.25,48.5 CN1.P2
N$51
  Top 0.254: R4.2 10.7,46.6 11,46.6 11.16,46.56
  Top 0.406: 12.95,48.35 13.6,49 CN1.P3 | 12.95,48.35 11.16,46.56 | V2.1 12.6,48 12.95,48.35
N$52
  Top 0.254: F1.1 17.5,45.5 17.4,45.5
  Top 0.406: 14.92,49.18 14.9,49.18 CN1.P1
  Top 0.61: 17.4,44.7 17.4,45.5 17.4,46.7 16,48.1 15.75,48.35 | 14.92,49.18 15.75,48.35 | V3.1 15.75,48.6 15.75,48.35
N$58
  Top 1.27: D1.A D2.K
SCK  (via drill 0.3)
  Top 0.254: IC1.9 v9.5,34.2 | ICSP.3 2.23,42.33 3.6,43.7 3.6,44.7 4.1,45.2 5.4,45.2 6.6,44 6.6,38.9 v9.5,36
  Bottom 0.254: v9.5,34.2 v9.5,36
TXLED
  Top 0.254: CN2.2 4.5,19.91 4.5,21.9 5.26,22.66 5.3,22.7 6.1,22.7 IC1.22
UCAP
  Top 0.254: IC1.6 11.9,32.9 12.7,33.7
  Top 0.305: 12.7,33.7 12.7,37.4 C7.2
USB+
  Top 0.406: IC1.4 13.5,41.76 R4.1
USB-
  Top 0.406: IC1.3 14.3,43.56 R3.1
WIFI_UART0_CTS
  Top 0.254: IC4.31 36.8,18 38,16.8 39.45,15.35 | 39.1,15.7 39.45,15.35 | 39.45,15.35 40.7,14.1 47.4,14.1 49.16,14.1 CN3.3
WIFI_UART0_RTS
  Top 0.254: IC4.32 38.2,17.8 40.6,15.4 | 40.2,15.8 40.6,15.4 | 40.6,15.4 41.4,14.6 47.7,14.6 48.7,15.6 49.8,15.6 50.66,15.6 CN3.2
WIFI_UART0_RX
  Top 0.254: CN3.5 48.96,12.1 43.7,12.1 37.5,12.1 36.2,13.4 | 36.2,13.4 36.2,16.9 35.4,17.7 IC4.30 | 36.2,13.4 34.7,11.9 34.6,11.8 R11.2 25.5,13.8 R10.1
WIFI_UART0_TX  (via drill 0.3)
  Top 0.254: 34.4,16.6 v35.5,16.6 | v47.8,13 47.7,13.1 39.2,13.1 38.9,13.4 v36.8,15.5
  Top 0.406: T2.2 33.75,16.45 R12.1 | R12.1 IC4.29 | R12.1 34.4,16.6
  Bottom 0.254: v35.5,16.6 35.7,16.6 v36.8,15.5 | v47.8,13 50.6,13 CN3.6
WIFI_UART1_RTS  (via drill 0.3)
  Top 0.254: IC4.26 29.8,17.9 30.4,17.3 v33.2,17.3 | 39.9,13.6 40.2,13.6 | 40.2,13.6 48.1,13.6 48.6,13.1 49.8,13.1 50.97,14.27 CN3.4 | v36.9,16.5 39.8,13.6 40.2,13.6
  Bottom 0.254: v33.2,17.3 36.1,17.3 v36.9,16.5
XTAL1
  Top 0.406: IC1.17 5.16,26.66 5.1,26.6 5,26 5,25.9 4,24.9 1.94,24.9 C6.2 1.74,25.1
  Top 0.813: XTAL1.1 1.4,25.44 C6.2
XTAL2
  Top 0.406: IC1.16 5.34,27.46 4.3,28.5 3.8,28.5 XTAL1.3
  Top 0.813: C5.2 3.6,28.7 XTAL1.3

### Text on the board
tPlace: +5V | GND | +3.3V | D5 | IRKit / v1.3.0 | +5V